# EAGLE schematic piezo-preamp-tickler_V3-2_single-supply-OPA1642 (EAGLE 8.5.0)

## Sheet 1 of 2
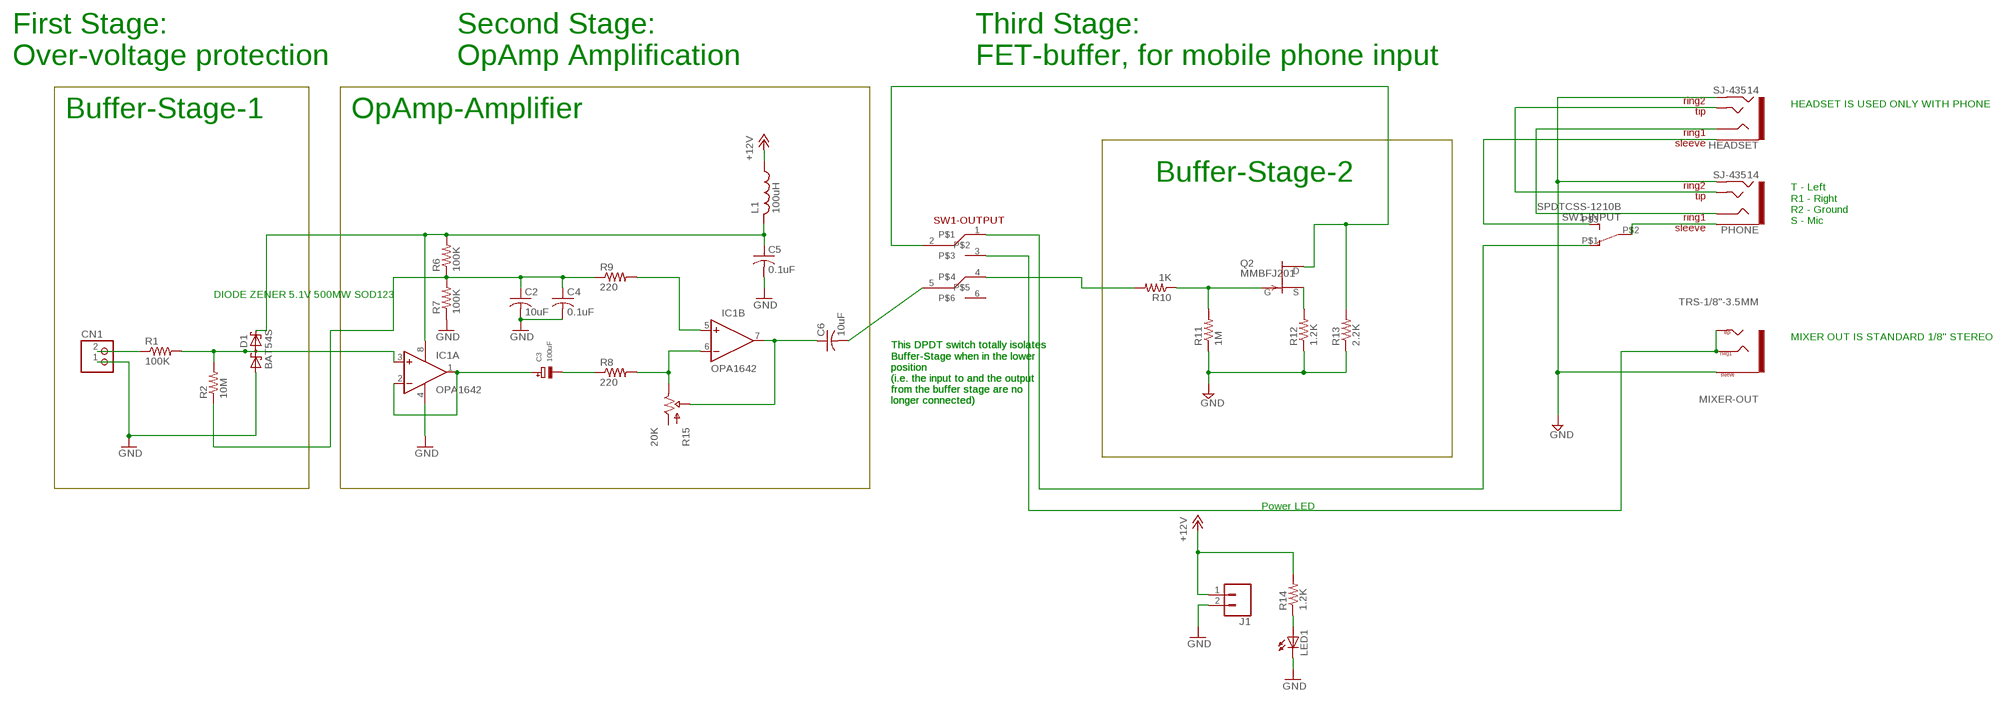
[diagram p0: schematic, sheet 1]

### Parts
C2  10uF  C-USC1206  [C1206]
C3  100uF  CAP_TANTALUMD/7343_REFLOW  [EIA7343-31/D-R]
C4  0.1uF  C-USC0805K  [C0805K]
C5  0.1uF  C-USC0805K  [C0805K]
C6  10uF  C-USC1206  [C1206]
CN1  JST_2PIN-THM  [JST-PH-2-THM]
D1  BAT54S  [SOT23]
HEADSET  SJ-43514  TRRS-3.5MMLGPADS  [TRRS_SJ-43514-SMT-TR]
IC1  OPA1642  OPA2134UA  [SO08]
J1  CONN_02LOCK  [1X02_LOCK]
L1  100uH  L-USL3225P  [L3225P]
LED1  LED3MM  [LED3MM]
MIXER-OUT  TRS-1/8"-3.5MM  [TRS_SJ-3524-SMT]
PHONE  SJ-43514  TRRS-3.5MMLGPADS  [TRRS_SJ-43514-SMT-TR]
Q2  MMBFJ201  SST5484  [SOT23]
R1  100K  R-US_R0603  [R0603]
R2  10M  R-US_R0603  [R0603]
R6  100K  R-US_R0603  [R0603]
R7  100K  R-US_R0603  [R0603]
R8  220  R-US_R0603  [R0603]
R9  220  R-US_R0603  [R0603]
R10  1K  R-US_R0603  [R0603]
R11  1M  R-US_R0603  [R0603]
R12  1.2K  R-US_R0603  [R0603]
R13  2.2K  R-US_R0603  [R0603]
R14  1.2K  R-US_R0603  [R0603]
R15  20K  POTTRIMPOT-MULTI  [TRIMPOT-MULTI]
SW1-INPUT  SPDTCSS-1210B  SWITCH_SPDTCSS-1210B  [SWITCH_SPDT_CSS-1210B]
SW1-OUTPUT  SWITCH_DPDT  [SWITCH_DPDT_CL-SB-22B]

### Nets
+12V: J1.1 L1.1 R14.2 ; also sheet 2
GATE2: Q2.3(G) R10.1 R11.2
GND: C2.2 C4.2 C5.2 CN1.1 D1.1(A1) HEADSET.RING2 IC1.4(A:V-) J1.2 LED1.K(C) MIXER-OUT.1(SLEEVE) PHONE.RING2 R7.1 R11.1 R12.1 R13.1 ; also sheet 2
N$1: C3.+ IC1.1(A:OUT) IC1.2(A:-IN)
N$2: LED1.A R14.1
N$3: R10.2 SW1-OUTPUT.4
N$5: D1.3(C1A2) IC1.3(A:+IN) R1.2 R2.2
N$6: Q2.2(S) R12.2
N$7: HEADSET.EARTH SW1-INPUT.P$3
N$8: SW1-INPUT.P$1 SW1-OUTPUT.1
N$9: MIXER-OUT.2(TIP) MIXER-OUT.3(RING1) MIXER-OUT.4(TIP) SW1-OUTPUT.3
N$16: IC1.5(B:+IN) R9.2
N$22: IC1.6(B:-IN) R8.2 R15.P$1(OUT) R15.P$3(OUT) R15.P$4(OUT) R15.P$6(OUT) R15.P$9(OUT)
N$23: C6.2 SW1-OUTPUT.5
N$24: CN1.2 R1.1
N$31: C6.1 IC1.7(B:OUT) R15.P$10(WIPER) R15.P$12(WIPER) R15.P$13(WIPER) R15.P$15(WIPER) R15.P$16(WIPER) R15.P$18(WIPER)
N$32: C5.1 D1.2(C2) IC1.8(A:V+) L1.2 R6.2
N$35: C2.1 C4.1 R2.1 R6.1 R7.2 R9.1
N$44: HEADSET.TIP PHONE.TIP
N$45: HEADSET.RING1 PHONE.RING1
N$46: PHONE.EARTH SW1-INPUT.P$2
N$52: C3.- R8.1
NAME: Q2.1(D) R13.2 SW1-OUTPUT.2
Unconnected: R15.P$20(IN) R15.P$21(IN) R15.P$22(IN) R15.P$24(IN) R15.P$27(IN) SW1-OUTPUT.6

### Notes on the sheet
- First Stage:
  Over-voltage protection
- Second Stage:
  OpAmp Amplification
- Third Stage:
  FET-buffer, for mobile phone input
- HEADSET IS USED ONLY WITH PHONE
- Buffer-Stage-1 | OpAmp-Amplifier
- Buffer-Stage-2
- T - Left
  R1 - Right
  R2 - Ground
  S - Mic
- DIODE ZENER 5.1V 500MW SOD123
- MIXER OUT IS STANDARD 1/8" STEREO
- This DPDT switch totally isolates 
  Buffer-Stage when in the lower 
  position 
  (i.e. the input to and the output 
  from the buffer stage are no 
  longer connected)
- This DPDT switch totally isolates 
  Buffer-Stage when in the lower 
  position 
  (i.e. the input to and the output 
  from the buffer stage are no 
  longer connected)
- Power LED

## Sheet 2 of 2
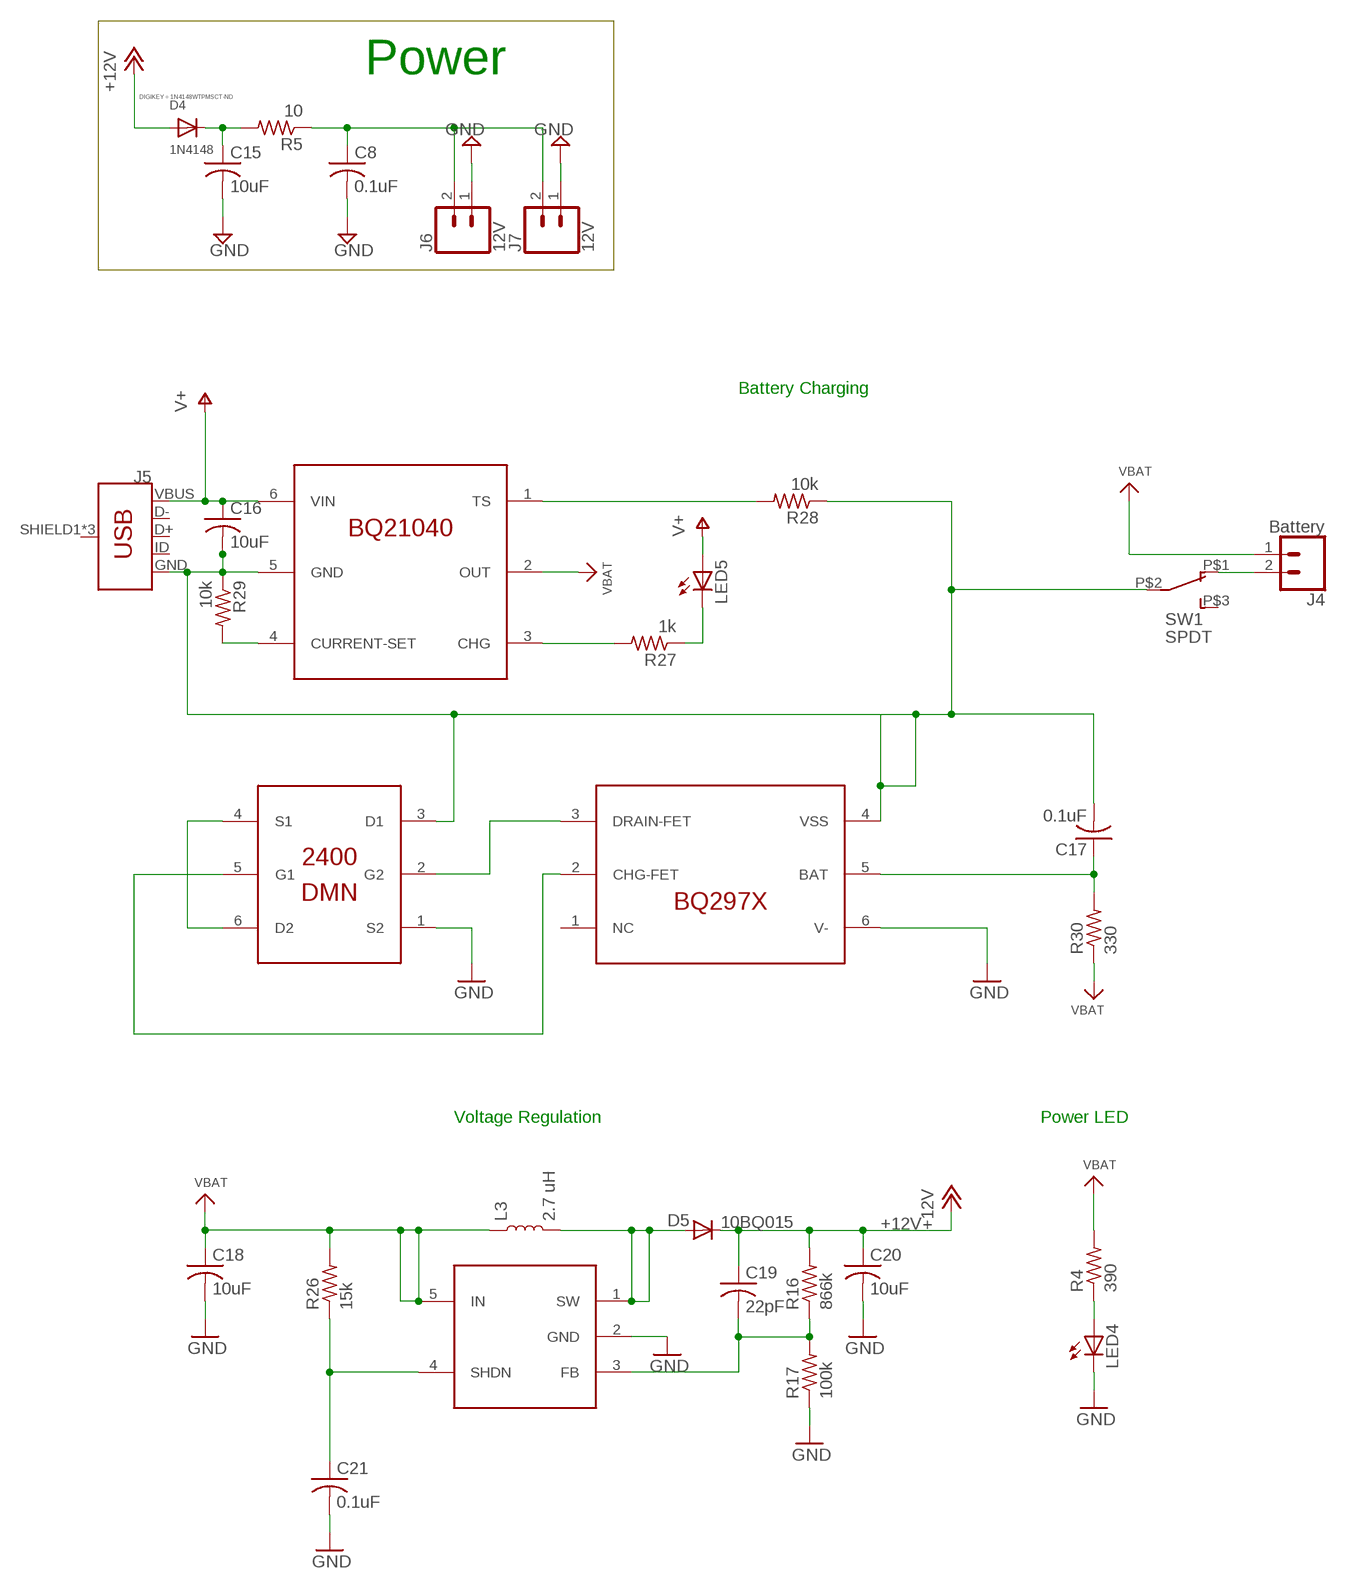
[diagram p1: schematic, sheet 2]

### Parts
C8  0.1uF  C-USC0805K  [C0805K]
C15  10uF  C-USC0805K  [C0805K]
C16  10uF  C-USC0805K  [C0805K]
C17  0.1uF  C-USC0805K  [C0805K]
C18  10uF  C-USC0805K  [C0805K]
C19  22pF  C-USC0805K  [C0805K]
C20  10uF  C-USC0805K  [C0805K]
C21  0.1uF  C-USC0805K  [C0805K]
D4  1N4148  DIODESOD-123  [SOD-123]
D5  10BQ015  DIODESMA  [SMA-DIODE]
J4  Battery  CONN_02LOCK  [1X02_LOCK]
J5  USB_MICRO-BREDUCED_PASTE  [USB-B-MICRO-SMD_RED_PASTE]
J6  12V  CONN_02  [1X02]
J7  12V  CONN_02  [1X02]
L3  2.7 uH  INDUCTOR-CR54-3.3UH  [CR54]
LED4  LED3MM  [LED3MM]
LED5  LED3MM  [LED3MM]
Q1  BQ21040  BQ21040-LIPO-CHARGER  [SOT23-6]
Q7  BQ297X  BQ297X-BATTERY-MANAGER  [WSON-6]
Q8  DMN2400  DUAL-NFET-DMN2400  [SOT-563]
Q9  SC4503  [SOT23-5]
R4  390  R-US_R0805  [R0805]
R5  10  R-US_R0805  [R0805]
R16  866k  R-US_R0805  [R0805]
R17  100k  R-US_R0805  [R0805]
R26  15k  R-US_R0805  [R0805]
R27  1k  R-US_R0805  [R0805]
R28  10k  R-US_R0805  [R0805]
R29  10k  R-US_R0805  [R0805]
R30  330  R-US_R0805  [R0805]
SW1  SPDT  SWITCH_SPDTCL-SB-12B  [SWITCH_SPDT_CL-SB-12B]

### Nets
+12V: C19.1 C20.1 D4.A D5.C R16.2 ; also sheet 1
GND: C8.2 C15.2 C18.2 C20.2 C21.2 J6.1 J7.1 LED4.K(C) Q7.6(V-) Q8.1(S2) Q9.2(GND) R17.1 ; also sheet 1
GND2: C16.2 C17.2 J5.GND Q1.5(GND) Q7.4(VSS) Q8.3(D1) R28.1 R29.1 SW1.P$2
N$13: LED4.A R4.1
N$14: J4.2 SW1.P$1
N$15: D5.A L3.P$2 Q9.1(SW)
N$17: C21.1 Q9.4(SHDN) R26.1
N$19: C19.2 Q9.3(FB) R16.1 R17.2
N$20: LED5.K(C) R27.1
N$25: Q1.3(CHG) R27.2
N$26: Q1.1(TS) R28.2
N$27: Q1.4(CURRENT-SET) R29.2
N$28: C17.1 Q7.5(BAT) R30.2
N$36: Q8.4(S1) Q8.6(D2)
N$42: Q7.2(CHG-FET) Q8.5(G1)
N$47: Q7.3(DRAIN-FET) Q8.2(G2)
N$48: C15.1 D4.C R5.2
N$49: C8.1 J6.2 J7.2 R5.1
V+: C16.1 J5.VBUS LED5.A Q1.6(VIN)
VBAT: C18.1 J4.1 L3.P$1 Q1.2(OUT) Q9.5(IN) R4.2 R26.2 R30.1
Unconnected: J5.D+ J5.D- J5.ID J5.SHIELD1(SHIELD) J5.SHIELD2(SHIELD) J5.SHIELD3(SHIELD) Q7.1(NC) SW1.P$3

### Notes on the sheet
- Power
- Battery Charging
- Voltage Regulation | Power LED

## Library data of the parts
C2 = rcl:C-US: CAPACITOR, American symbol
C3 = microbuilder:CAP_TANTALUM: Tantalum Capacitors Wave footprints have larger pads and are meant to be used for hand soldering. Reflow footprints are optimised for solder paste and a reflow oven. EIA3216-18/A-[R/W] - Size A / 3216-18 / 1206 footprint 4.7µF 25V 10% Tantalum Capacitor 10µF 16V 10% Tantalum Capacitor [Digikey: 495-2236-2-ND] EIA3528-21/B-[R/W] - Size B / 3528-21 47µF 10V 10% Tantalum Capactior [Digikey: 495-2216-1-ND] EIA6032-28/C-[R/W] - Size C / 6032-28 10µF 35V 20% Tantalum Capacitor [Digikey: 495-2285-1-ND] 100µF 16V 10% Tantalum Capactior [Digikey: 399-5214-1-ND]
C4-C6 C8 C15-C21 = adafruit:C-US: CAPACITOR, American symbol
CN1 = adafruit:JST_2PIN: JST 2-Pin Connectors of various flavors SMT-RA (S2B-PH-SM4) 4UConnector #17311 SMT (B2B-PH-SM4) THM-RA (S2B-PH) THM (B2B-PH)
D1 = diode:BAT54S: Schottky Diodes Pin connection corrected 2011-05-04 Source: Fairchild .. BAT54.pdf
D4 = adafruit:DIODE: Diode; DIGIKEY: 1N4148WTPMSCT-ND
D5 = SparkFun:DIODE: Diode
HEADSET PHONE = CMU-ArtFab:TRRS-3.5MM: Audio jack - 3.5mm TRRS variety - two rings.
IC1 = linear:OPA2*: Dual Operational Amplifier Low Power, Single-Supply, Rail-To-Rail Operational Amplifier Source: http://focus.ti.com/lit/ds/symlink/opa2345.pdf http://focus.ti.com .. opa241.pdf http://focus.ti.com/lit/ds/symlink/opa2134.pdf
J1 J4 J6 J7 = SparkFun-Connectors:CONN_02: Multi connection point. Often used as Generic Header-pin footprint for 0.1 inch spaced/style header connections On any of the 0.1 inch spaced packages, you can populate with these: Break Away Headers - Straight <https://www.sparkfun.com/products/116> (PRT-00116) Break Away Male Headers - Right Angle <https://www.sparkfun.com/products/553> (PRT-00553) Female Headers <https://www.sparkfun.com/products/115> (PRT-00115) Break Away Headers - Machine Pin <https://www.sparkfun.com/products/117> (PRT-00117) Break Away Female Headers - Swiss Machine Pin <https://www.sparkfun.com/products/743> (PRT-00743) For SCREWTERMINALS and SPRING TERMINALS visit here: Screw Terimnals on SparkFun.com <https://www.sparkfun.com/search/results?term=Screw+Terminals> (5mm/3.5mm/2.54mm spacing) This device is also useful as a general connection point to wire up your design to another part of your project. Our various solder wires solder well into these plated through hole pads. Hook-Up Wire - Assortment (Stranded, 22 AWG) <https://www.sparkfun.com/products/11375> (PRT-11375) Hook-Up Wire - Assortment (Solid Core, 22 AWG) <https://www.sparkfun.com/products/11367> (PRT-11367) View the entire wire category on our website here <https://www.sparkfun.com/categories/141> Special notes: Molex polarized connector foot print use with: PRT-08233 with associated crimp pins and housings. 2.54_SCREWTERM for use with PRT-10571. 3.5mm Screw Terminal footprints for PRT-08084 5mm Screw Terminal footprints for use with PRT-08432
J5 = SparkFun-Connectors:USB_MICRO-B: USB Type Micro-B Connector Male/female and PTH/SMT variants SparkFun Products: SparkFun microB USB Breakout <https://www.sparkfun.com/products/12035> SparkFun USB microB Plug Breakout <https://www.sparkfun.com/products/10031> SparkFun ESP8266 Thing <https://www.sparkfun.com/products/13231>; PROD_ID: CONN-11752
L1 = rcl:L-US: INDUCTOR, American symbol; SPICEPREFIX: L
L3 = SparkFun-Coils:INDUCTOR: Inductors Resist changes in electrical current. Basically a coil of wire. SparkFun Products: SparkFun Load Cell Amplifier - HX711 <https://www.sparkfun.com/products/13879> IOIO-OTG - V2.2 <https://www.sparkfun.com/products/13613>; PROD_ID: NDUC-11157; VALUE: 3.3µH/±30%/3.4A
LED1 LED4 LED5 = led:LED: LED OSRAM: - CHIPLED LG R971, LG N971, LY N971, LG Q971, LY Q971, LO R971, LY R971 LH N974, LH R974 LS Q976, LO Q976, LY Q976 LO Q996 - Hyper CHIPLED LW Q18S LB Q993, LB Q99A, LB R99A - SideLED LS A670, LO A670, LY A670, LG A670, LP A670 LB A673, LV A673, LT A673, LW A673 LH A674 LY A675 LS A676, LA A676, LO A676, LY A676, LW A676 LS A679, LY A679, LG A679 - Hyper Micro SIDELED® LS Y876, LA Y876, LO Y876, LY Y876 LT Y87S - SmartLED LW L88C, LW L88S LB L89C, LB L89S, LG L890 LS L89K, LO L89K, LY L89K LS L896, LA L896, LO L896, LY L896 - TOPLED LS T670, LO T670, LY T670, LG T670, LP T670 LSG T670, LSP T670, LSY T670, LOP T670, LYG T670 LG T671, LOG T671, LSG T671 LB T673, LV T673, LT T673, LW T673 LH T674 LS T676, LA T676, LO T676, LY T676, LB T676, LH T676, LSB T676, LW T676 LB T67C, LV T67C, LT T67C, LS T67K, LO T67K, LY T67K, LW E67C LS E67B, LA E67B, LO E67B, LY E67B, LB E67C, LV E67C, LT E67C LW T67C LS T679, LY T679, LG T679 LS T770, LO T770, LY T770, LG T770, LP T770 LB T773, LV T773, LT T773, LW T773 LH T774 LS E675, LA E675, LY E675, LS T675 LS T776, LA T776, LO T776, LY T776, LB T776 LHGB T686 LT T68C, LB T68C - Hyper Mini TOPLED® LB M676 - Mini TOPLED Santana® LG M470 LS M47K, LO M47K, LY M47K Source: http://www.osram.convergy.de LUXEON: - LUMILED® LXK2-PW12-R00, LXK2-PW12-S00, LXK2-PW14-U00, LXK2-PW14-V00 LXK2-PM12-R00, LXK2-PM12-S00, LXK2-PM14-U00 LXK2-PE12-Q00, LXK2-PE12-R00, LXK2-PE12-S00, LXK2-PE14-T00, LXK2-PE14-U00 LXK2-PB12-K00, LXK2-PB12-L00, LXK2-PB12-M00, LXK2-PB14-N00, LXK2-PB14-P00, LXK2-PB14-Q00 LXK2-PR12-L00, LXK2-PR12-M00, LXK2-PR14-Q00, LXK2-PR14-R00 LXK2-PD12-Q00, LXK2-PD12-R00, LXK2-PD12-S00 LXK2-PH12-R00, LXK2-PH12-S00 LXK2-PL12-P00, LXK2-PL12-Q00, LXK2-PL12-R00 Source: www.luxeon.com KINGBRIGHT: KA-3528ASYC Source: www.kingbright.com
MIXER-OUT = CMU-ArtFab:TRS-1/8"-3.5MM
Q1 = CMU-ArtFab:BQ21040-LIPO-CHARGER
Q2 = transistor-fet:?548*: N-Channel JFETs Source: VISHAY 2N5484.pdf Compatible: TO92 2N5245 J304 J305 U310 J308 J309 J310 TO72 2N4416 2N4416A 2N3823 2N4351 3N169 3N170 3N171 MFE3002 TO18 2N3796 2N3797 MFE825 Source: Motorola European Master Guide Pacge 3-59
Q7 = CMU-ArtFab:BQ297X-BATTERY-MANAGER
Q8 = CMU-ArtFab:DUAL-NFET-DMN2400
Q9 = CMU-ArtFab:SC4503
R1 R2 R4-R14 R16 R17 R26-R30 = CMU-ArtFab:R-US_: RESISTOR, American symbol
R15 = CMU-ArtFab:POT: http://www.taydaelectronics.com/10k-ohm-linear-taper-potentiometer-round-shaft-pcb-9mm.html http://www.taydaelectronics.com/datasheets/A-1847.pdf
SW1 SW1-INPUT = CMU-ArtFab:SWITCH_SPDT
SW1-OUTPUT = CMU-ArtFab:SWITCH_DPDT

## Net classes
0 default: width 0.152 mm, clearance 0.2 mm